# Altium schematic sheet Audio.SchDoc: Audio
size A4; Date: Not used; ApprovedBy: Not used; CheckedBy: Not used; Author: Not used; CompanyName: STMicroelectronics; DrawnBy: Not used; Engineer: Not used; Organization: Not used; Address1: Not used; Address2: Not used; Address3: Not used; Address4: Not used; DocumentNumber: Not used; Revision: Not used; SheetNumber: 9; SheetTotal: 22; CurrentTime: Not used; CurrentDate: Not used; Time: Not used; DocumentFullPathAndName: Not used; DocumentName: Not used; ModifiedDate: Not used; ImagePath: Not used; ProjectName: Not used; Application_BuildNumber: Not used
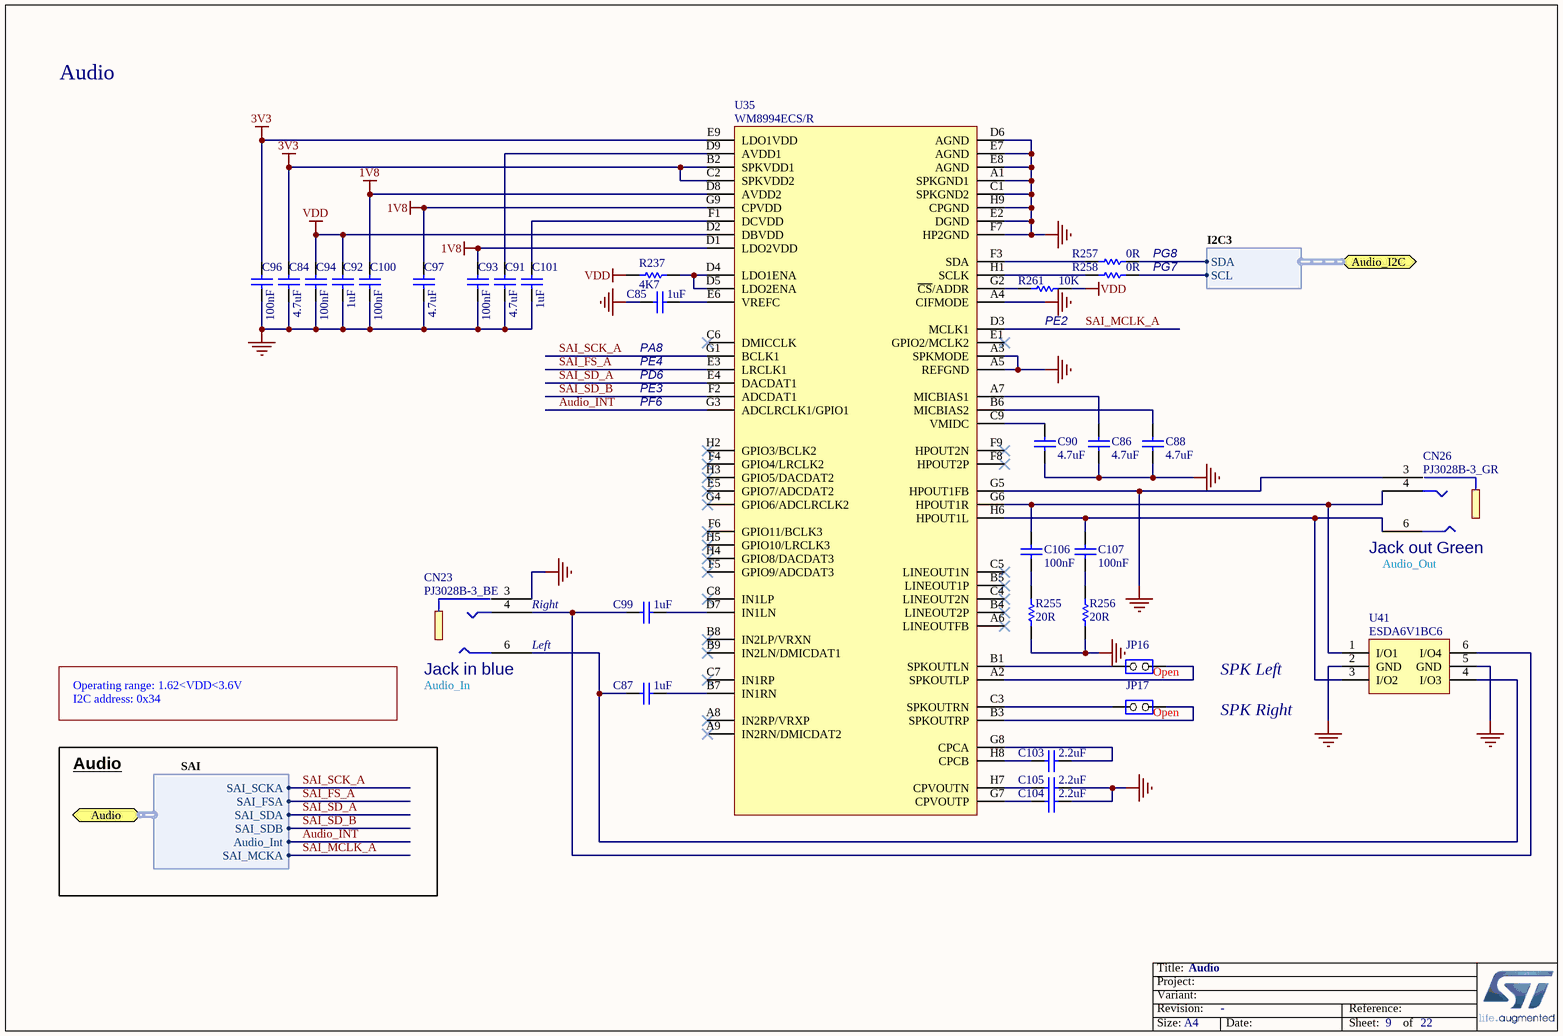
[diagram p0: Audio.SchDoc]

## Parts
C84  value 4.7uF  [C0603]  (hidden comment: Capacitor)
C85  value 1uF  [C0603]  (hidden comment: Capacitor)
C86  value 4.7uF  [C0603]  (hidden comment: Capacitor)
C87  value 1uF  [C0603]  (hidden comment: Capacitor)
C88  value 4.7uF  [C0603]  (hidden comment: Capacitor)
C90  value 4.7uF  [C0603]  (hidden comment: Capacitor)
C91  value 4.7uF  [C0603]  (hidden comment: Capacitor)
C92  value 1uF  [C0603]  (hidden comment: Capacitor)
C93  value 100nF  [C0402]  (hidden comment: Capacitor)
C94  value 100nF  [C0402]  (hidden comment: Capacitor)
C96  value 100nF  [C0402]  (hidden comment: Capacitor)
C97  value 4.7uF  [C0603]  (hidden comment: Capacitor)
C99  value 1uF  [C0603]  (hidden comment: Capacitor)
C100  value 100nF  [C0402]  (hidden comment: Capacitor)
C101  value 1uF  [C0603]  (hidden comment: Capacitor)
C103  value 2.2uF  [C0603]  (hidden comment: Capacitor)
C104  value 2.2uF  [C0603]  (hidden comment: Capacitor)
C105  value 2.2uF  [C0603]  (hidden comment: Capacitor)
C106  value 100nF  [C0402]  (hidden comment: Capacitor)
C107  value 100nF  [C0402]  (hidden comment: Capacitor)
CN23  value PJ3028B-3_BE  [CON_PHONE-JACK-3P5_HY_PJ3028B]  (hidden comment: Jack_PJ3028B-3_3P)
CN26  value PJ3028B-3_GR  [CON_PHONE-JACK-3P5_HY_PJ3028B]  (hidden comment: Jack_PJ3028B-3_3P)
JP16  Jumper_Header 2x1  [CON_SAMTEC_TSW-102-07-G-S]  (value not drawn)
JP17  Jumper_Header 2x1  [CON_SAMTEC_TSW-102-07-G-S]  (value not drawn)
R237  value 4K7  [R0402]  (hidden comment: Resistor)
R255  value 20R  [R0603]  (hidden comment: Resistor)
R256  value 20R  [R0603]  (hidden comment: Resistor)
R257  value 0R  [R0603]  (hidden comment: Resistor)
R258  value 0R  [R0603]  (hidden comment: Resistor)
R261  value 10K  [R0402]  (hidden comment: Resistor)
U35  WM8994ECS/R  [ICC_W-CSP-BGA72_4P511X4P023_P050]
U41  ESDA6V1BC6  [ESD_SOT23-6L]

## Ports
Audio (harness SAI), Audio_I2C (harness I2C3)

## Harnesses
I2C3: SDA, SCL
SAI: SAI_SDB, SAI_FSA, Audio_Int, SAI_SDA, SAI_SCKA, SAI_MCKA

## Nets
1V8: C93.1 C97.2 C100.1 U35.D1(LDO2VDD) U35.D8(AVDD2) U35.G9(CPVDD)
3V3: C84.2 C96.1 U35.B2(SPKVDD1) U35.C2(SPKVDD2) U35.E9(LDO1VDD)
GND: C84.1 C85.2 C86.1 C88.1 C90.1 C91.1 C92.1 C93.2 C94.2 C96.2 C97.1 C100.2 C101.1 C104.1 C105.1 CN23.3 CN26.3 R255.1 R256.1 U35.A1(SPKGND1) U35.A3(SPKMODE) U35.A4(CIFMODE) U35.A5(REFGND) U35.C1(SPKGND2) U35.D6(AGND) U35.E2(DGND) U35.E7(AGND) U35.E8(AGND) U35.F7(HP2GND) U35.G5(HPOUT1FB) U35.H9(CPGND) U41.2(GND) U41.5(GND)
VDD: C92.2 C94.1 R237.1 R261.1 U35.D2(DBVDD)
Audio_INT: U35.G3(ADCLRCLK1/GPIO1) ; port Audio.Audio_Int
SAI_FS_A: U35.E3(LRCLK1) ; port Audio.SAI_FSA
SAI_MCLK_A: U35.D3(MCLK1) ; port Audio.SAI_MCKA
SAI_SCK_A: U35.G1(BCLK1) ; port Audio.SAI_SCKA
SAI_SD_A: U35.E4(DACDAT1) ; port Audio.SAI_SDA
SAI_SD_B: U35.F2(ADCDAT1) ; port Audio.SAI_SDB
NetC85_1: C85.1 U35.E6(VREFC)
NetC86_2: C86.2 U35.A7(MICBIAS1)
NetC87_1: C87.1 U35.B7(IN1RN)
NetC87_2: C87.2 CN23.6 U41.4(I/O3)
NetC88_2: C88.2 U35.B6(MICBIAS2)
NetC90_2: C90.2 U35.C9(VMIDC)
NetC91_2: C91.2 U35.D9(AVDD1)
NetC99_1: C99.1 U35.D7(IN1LN)
NetC99_2: C99.2 CN23.4 U41.6(I/O4)
NetC101_2: C101.2 U35.F1(DCVDD)
NetC103_1: C103.1 U35.G8(CPCA)
NetC103_2: C103.2 U35.H8(CPCB)
NetC104_2: C104.2 U35.G7(CPVOUTP)
NetC105_2: C105.2 U35.H7(CPVOUTN)
NetC106_1: C106.1 CN26.4 U35.G6(HPOUT1R) U41.1(I/O1)
NetC106_2: C106.2 R255.2
NetC107_1: C107.1 CN26.6 U35.H6(HPOUT1L) U41.3(I/O2)
NetC107_2: C107.2 R256.2
NetJP16_1: JP16.1(COMMON) U35.A2(SPKOUTLP)
NetJP16_2: JP16.2(NO) U35.B1(SPKOUTLN)
NetJP17_1: JP17.1(COMMON) U35.B3(SPKOUTRP)
NetJP17_2: JP17.2(NO) U35.C3(SPKOUTRN)
NetR237_2: R237.2 U35.D4(LDO1ENA) U35.D5(LDO2ENA)
NetR257_1: R257.1 U35.F3(SDA)
NetR257_2: R257.2 ; port Audio_I2C.SDA
NetR258_1: R258.1 U35.H1(SCLK)
NetR258_2: R258.2 ; port Audio_I2C.SCL
NetR261_2: R261.2 U35.G2(~{CS}/ADDR)

Not connected (* = marked no-connect by the designer): U35 A6(LINEOUTFB)* A8(IN2RP/VRXP)* A9(IN2RN/DMICDAT2)* B4(LINEOUT2P)* B5(LINEOUT1P)* B8(IN2LP/VRXN)* B9(IN2LN/DMICDAT1)* C4(LINEOUT2N)* C5(LINEOUT1N)* C6(DMICCLK)* C7(IN1RP)* C8(IN1LP)* E1(GPIO2/MCLK2)* E5(GPIO7/ADCDAT2)* F4(GPIO4/LRCLK2)* F5(GPIO9/ADCDAT3)* F6(GPIO11/BCLK3)* F8(HPOUT2P)* F9(HPOUT2N)* G4(GPIO6/ADCLRCLK2)* H2(GPIO3/BCLK2)* H3(GPIO5/DACDAT2)* H4(GPIO8/DACDAT3)* H5(GPIO10/LRCLK3)*

## Notes on the sheet
- Audio
- PG8
- PG7
- (near C85) PA8
- PD6
- PE4
- (near R261) PE2
- PE3
- PF6
- (near CN26) Jack out Green
- (near CN26) Audio_Out
- (near CN23) Right
- (near CN23) Left
- Operating range: 1.62<VDD<3.6V
- I2C address: 0x34
- (near CN23) Jack in blue
- (near CN23) Audio_In
- (near JP16) Open
- (near JP17) Open
- SPK Left
- SPK Right
- Title:
- Project:
- Size:
- Revision:
- Variant:
- A4
- -
- Date:
- Reference:
- Sheet:
- of

## Library data of the parts
C84 C86 C88 C90 C91 C97 = MCD-00009: Capacitor, MLCC, 4.7uF, 16V, X5R, 10%, 0603, T=0.8mm; Manufacturer_Part_Number: CC0603KRX5R7BB475; Manufacturer: YAGEO; Provided_By: SUBCO; Initial_Board_Reference: MB1274; Path: ws/MCD_ApplicationBoards/Lists/MCDPARTSdatabase; Item Type: Item; Internal_Part_Number: MCD-00009; Status: Released; Part_Type: Capacitor; Package: C0603; ComponentLink1Description: Datasheet; ComponentLink1URL: http://tunmcdsvn.tun.st.com/Component_Datasheet_Library/Trunk/Capacitors/Yageo_Multilayer_capacitor_X5R_series_100pF_to_100uF
C85 C87 C92 C99 C101 = MCD-00010: Capacitor, MLCC, 1uF, 16V, X5R, 10%, 0603, T=0,8mm; Manufacturer_Part_Number: CC0603KRX5R7BB105; Manufacturer: YAGEO; Provided_By: SUBCO; Initial_Board_Reference: MB1274; Path: ws/MCD_ApplicationBoards/Lists/MCDPARTSdatabase; Item Type: Item; Internal_Part_Number: MCD-00010; Status: Released; Part_Type: Capacitor; Package: C0603; ComponentLink1Description: Datasheet; ComponentLink1URL: http://tunmcdsvn.tun.st.com/Component_Datasheet_Library/Trunk/Capacitors/Yageo_Multilayer_capacitor_X5R_series_100pF_to_100uF
C93 C94 C96 C100 C106 C107 = MCD-00006: Capacitor, MLCC, 100nF, 16V, X7R, 10%, 0402, T=0.5mm; Manufacturer_Part_Number: CC0402KRX7R7BB104; Manufacturer: YAGEO; Alternate_Manufacturer_Part_Number: GCM155R71C104KA55D; Alternate_Manufacturer: MURATA; Provided_By: SUBCO; Initial_Board_Reference: MB1274; Path: ws/MCD_ApplicationBoards/Lists/MCDPARTSdatabase; Item Type: Item; Internal_Part_Number: MCD-00006; Status: Released; Part_Type: Capacitor; Package: C0402; ComponentLink1Description: Datasheet; ComponentLink1URL: http://tunmcdsvn.tun.st.com/Component_Datasheet_Library/Trunk/Capacitors/Yageo_Multilayer_Capacitor_X7R_series_100pF_to_22uF
C103-C105 = MCD-00012: Capacitor, MLCC, 2.2uF, 10V, X5R, 10%, 0603, T=0,8mm; Manufacturer_Part_Number: CC0603KRX5R6BB225; Manufacturer: YAGEO; Alternate_Manufacturer_Part_Number: C0603C225K8PACTU; Alternate_Manufacturer: KEMET; Provided_By: SUBCO; Initial_Board_Reference: MB1274; Path: ws/MCD_ApplicationBoards/Lists/MCDPARTSdatabase; Item Type: Item; Internal_Part_Number: MCD-00012; Status: Released; Part_Type: Capacitor; Package: C0603; ComponentLink1Description: Datasheet; ComponentLink1URL: http://tunmcdsvn.tun.st.com/Component_Datasheet_Library/Trunk/Capacitors/Yageo_Multilayer_capacitor_X5R_series_100pF_to_100uF
CN23 = MCD-00682: Connector Jack socket Stereo 3.5mm, 3 pins, RA, SMT, Blue (Line input); Manufacturer: QIAOD; Alternate_Manufacturer_Part_Number: PJ30280-3_BE; Provided_By: SUBCO; Initial_Board_Reference: MB1260; Path: ws/MCD_ApplicationBoards/Lists/MCDPARTSdatabase; Item Type: Item; Internal_Part_Number: MCD-00682; Status: Footprint available; Part_Type: Connector; Manufacturer_Part_Number: PJ3028B-3_BE; Alternate_Manufacturer: QIAOD; ComponentLink1Description: Datasheet; ComponentLink1URL: http://tunmcdsvn.tun.st.com/Component_Datasheet_Library/Trunk/Connectors/QIAOD_PJ-3028B-3-XX
CN26 = MCD-00018: Connector Jack socket Stereo 3.5mm, 3 pins, RA, SMT, Green (Line output); Manufacturer: QIAOD; Alternate_Manufacturer_Part_Number: PJ30280-3_GR; Provided_By: SUBCO; Initial_Board_Reference: MB1274; Path: ws/MCD_ApplicationBoards/Lists/MCDPARTSdatabase; Item Type: Item; Internal_Part_Number: MCD-00018; Status: Released; Part_Type: Connector; Manufacturer_Part_Number: PJ3028B-3_GR; Alternate_Manufacturer: QIAOD; ComponentLink1Description: Datasheet; ComponentLink1URL: http://tunmcdsvn.tun.st.com/Component_Datasheet_Library/Trunk/Connectors/QIAOD_PJ-3028B-3-XX
JP16 JP17 = MCD-00045: Header, 2x1, 2,54mm, VR, TH, Height 5.84mm/2.54mm; Part_Type: Connector; Manufacturer_Part_Number: TSW-102-07-x-S; Manufacturer: SAMTEC; Value: Shunt not fitted; Provided_By: SUBCO; Initial_Board_Reference: MB1274; Path: ws/MCD_ApplicationBoards/Lists/MCDPARTSdatabase; Item Type: Item; Internal_Part_Number: MCD-00045; Status: Released; ComponentLink1Description: Datasheet; ComponentLink1URL: http://tunmcdsvn.tun.st.com/Component_Datasheet_Library/Trunk/Connectors/Samtec_TSW-HTSW-series
R237 = MCD-00065: Resistor,4K7,0402,1%,1/16W; Manufacturer_Part_Number: RC0402FR-074K7L; Manufacturer: YAGEO; Alternate_Manufacturer_Part_Number: RT0402FRE074K7L; Provided_By: SUBCO; Initial_Board_Reference: MB1274; Path: ws/MCD_ApplicationBoards/Lists/MCDPARTSdatabase; Item Type: Item; Internal_Part_Number: MCD-00065; Status: Released; Part_Type: Resistor; Package: R0402; ComponentLink1Description: Datasheet; ComponentLink1URL: http://tunmcdsvn.tun.st.com/Component_Datasheet_Library/Trunk/Resistors/Yageo_Resistor_RC0402-series; Alternate_Manufacturer: YAGEO
R255 R256 = MCD-00345: Resistor,20R,0603,1%,1/10W; Manufacturer_Part_Number: RC0603FR-0720RL; Manufacturer: YAGEO; Provided_By: SUBCO; Initial_Board_Reference: MBxxxx; Path: ws/MCD_ApplicationBoards/Lists/MCDPARTSdatabase; Item Type: Item; Internal_Part_Number: MCD-00345; Status: Released; Part_Type: Resistor; Package: R0603; ComponentLink1Description: Datasheet; ComponentLink1URL: http://tunmcdsvn.tun.st.com/Component_Datasheet_Library/Trunk/Resistors/Yageo_Resistor_RC0603-series
R257 R258 = MCD-00056: Resistor,0R,0603,5%,1/10W; Manufacturer_Part_Number: RC0603JR-070RL; Manufacturer: YAGEO; Provided_By: SUBCO; Initial_Board_Reference: MB1274; Path: ws/MCD_ApplicationBoards/Lists/MCDPARTSdatabase; Item Type: Item; Internal_Part_Number: MCD-00056; Status: Released; Part_Type: Resistor; Package: R0603; ComponentLink1Description: Datasheet; ComponentLink1URL: http://tunmcdsvn.tun.st.com/Component_Datasheet_Library/Trunk/Resistors/Yageo_Resistor_RC0603-series
R261 = MCD-00053: Resistor,10K,0402,1%,1/16W; Manufacturer_Part_Number: RC0402FR-0710KL; Manufacturer: YAGEO; Provided_By: SUBCO; Initial_Board_Reference: MB1274; Path: ws/MCD_ApplicationBoards/Lists/MCDPARTSdatabase; Item Type: Item; Internal_Part_Number: MCD-00053; Status: Released; Part_Type: Resistor; Package: R0402; ComponentLink1Description: Datasheet; ComponentLink1URL: http://tunmcdsvn.tun.st.com/Component_Datasheet_Library/Trunk/Resistors/Yageo_Resistor_RC0402-series
U35 = MCD-00079: Multi-Channel Audio Hub CODEC for Smartphones; Part_Type: IC; Manufacturer: CIRRUS LOGIC; Provided_By: SUBCO; Initial_Board_Reference: MB1274; Path: ws/MCD_ApplicationBoards/Lists/MCDPARTSdatabase; Item Type: Item; Internal_Part_Number: MCD-00079; Value: WM8994ECS/R; Status: Released; Manufacturer_Part_Number: WM8994ECS/R; ComponentLink1Description: Datasheet; ComponentLink1URL: http://tunmcdsvn.tun.st.com/Component_Datasheet_Library/Trunk/IC/Wolfson_AudioCodec_WM8994
U41 = MCD-00247: Quad Bidir ESD protection; Part_Type: Diode; Manufacturer: STMICROELECTRONICS; BMS_Part_Number: 9179038; Provided_By: SUBCO with ST control; Initial_Board_Reference: MB1311; Path: ws/MCD_ApplicationBoards/Lists/MCDPARTSdatabase; Item Type: Item; Internal_Part_Number: MCD-00247; Value: ESDA6V1BC6; Status: Released; Manufacturer_Part_Number: ESDA6V1BC6; ComponentLink1Description: Datasheet; ComponentLink1URL: http://tunmcdsvn.tun.st.com/Component_Datasheet_Library/Trunk/Diodes/STM_ESD_ESDA6V1BC6